# EAGLE design autoset-main (EAGLE 7.5.0)

## Sheet 1 of 2
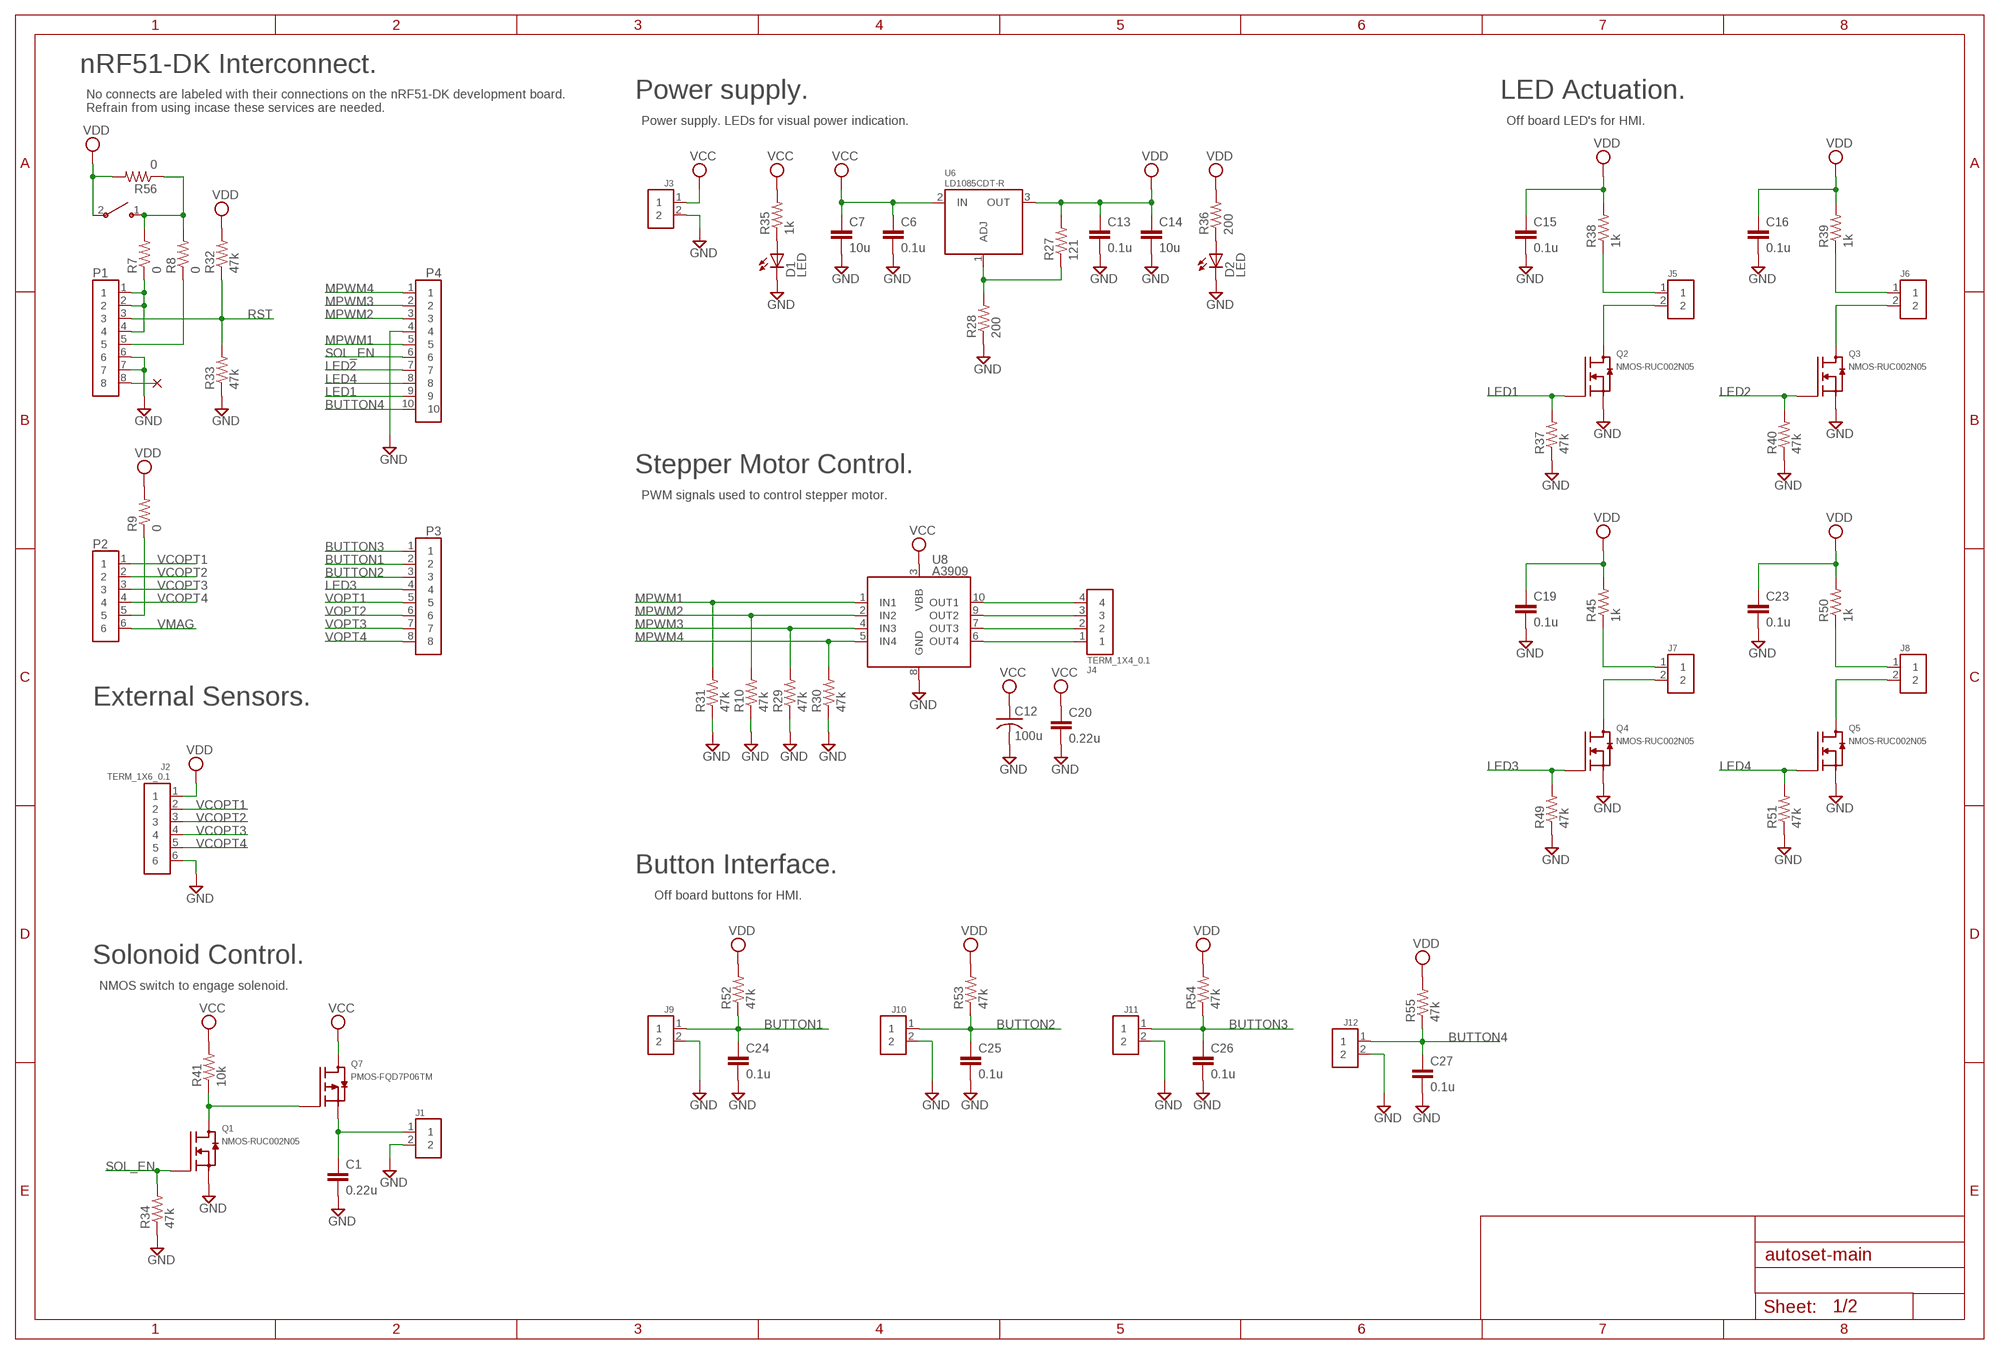
[diagram p0: schematic, sheet 1]

### Parts
C1  0.22u  C0603  [C0603]
C6  0.1u  C0603  [C0603]
C7  10u  C0603  [C0603]
C12  100u  C-POL3.5MM  [CPOL-3.5MM]
C13  0.1u  C0603  [C0603]
C14  10u  C0603  [C0603]
C15  0.1u  C0603  [C0603]
C16  0.1u  C0603  [C0603]
C19  0.1u  C0603  [C0603]
C20  0.22u  C0603  [C0603]
C23  0.1u  C0603  [C0603]
C24  0.1u  C0603  [C0603]
C25  0.1u  C0603  [C0603]
C26  0.1u  C0603  [C0603]
C27  0.1u  C0603  [C0603]
D1  LED  [L0805]
D2  LED  [L0805]
J1  TERM_1X2_0.1  [TERM_1X2_0.1]
J2  TERM_1X6_0.1  [TERM_1X6_0.1]
J3  TERM_1X2_0.1  [TERM_1X2_0.1]
J4  TERM_1X4_0.1  [TERM_1X4_0.1]
J5  TERM_1X2_0.1  [TERM_1X2_0.1]
J6  TERM_1X2_0.1  [TERM_1X2_0.1]
J7  TERM_1X2_0.1  [TERM_1X2_0.1]
J8  TERM_1X2_0.1  [TERM_1X2_0.1]
J9  TERM_1X2_0.1  [TERM_1X2_0.1]
J10  TERM_1X2_0.1  [TERM_1X2_0.1]
J11  TERM_1X2_0.1  [TERM_1X2_0.1]
J12  TERM_1X2_0.1  [TERM_1X2_0.1]
P1  RECT_1X8  [RECT_1X8_0.1]
P2  RECT_1X6  [RECT_1X6_0.1]
P3  RECT_1X8  [RECT_1X8_0.1]
P4  RECT_1X10  [RECT_1X10_0.1]
Q1  NMOS-RUC002N05  [SOT23]
Q2  NMOS-RUC002N05  [SOT23]
Q3  NMOS-RUC002N05  [SOT23]
Q4  NMOS-RUC002N05  [SOT23]
Q5  NMOS-RUC002N05  [SOT23]
Q7  PMOS-FQD7P06TM  [TO252]
R7  0  R0603  [R0603]
R8  0  R0603  [R0603]
R9  0  R0603  [R0603]
R10  47k  R0603  [R0603]
R27  121  R0603  [R0603]
R28  200  R0603  [R0603]
R29  47k  R0603  [R0603]
R30  47k  R0603  [R0603]
R31  47k  R0603  [R0603]
R32  47k  R0603  [R0603]
R33  47k  R0603  [R0603]
R34  47k  R0603  [R0603]
R35  1k  R0603  [R0603]
R36  200  R0603  [R0603]
R37  47k  R0603  [R0603]
R38  1k  R0603  [R0603]
R39  1k  R0603  [R0603]
R40  47k  R0603  [R0603]
R41  10k  R0603  [R0603]
R45  1k  R0603  [R0603]
R49  47k  R0603  [R0603]
R50  1k  R0603  [R0603]
R51  47k  R0603  [R0603]
R52  47k  R0603  [R0603]
R53  47k  R0603  [R0603]
R54  47k  R0603  [R0603]
R55  47k  R0603  [R0603]
R56  0  R0603  [R0603]
SW1  GPTS203211B  [GPTS203211B]
U6  LD1085CDT-R  [TO252]
U8  A3909  [SSOP10]
Z15  NC  [NC_TH]

### Nets
BUTTON1: C24.1 J9.1 P3.2 R52.1
BUTTON2: C25.1 J10.1 P3.3 R53.1
BUTTON3: C26.1 J11.1 P3.1 R54.1
BUTTON4: C27.1 J12.1 P4.10 R55.1
GND: C1.2 C6.2 C7.2 C12.P$2 C13.2 C14.2 C15.2 C16.2 C19.2 C20.2 C23.2 C24.2 C25.2 C26.2 C27.2 D1.2(C) D2.2(C) J1.2 J2.6 J3.2 J9.2 J10.2 J11.2 J12.2 P1.6 P1.7 P4.4 Q1.1(S) Q2.1(S) Q3.1(S) Q4.1(S) Q5.1(S) R10.1 R28.1 R29.1 R30.1 R31.1 R33.1 R34.1 R37.1 R40.1 R49.1 R51.1 U8.8(GND) ; also sheet 2
LED1: P4.9 Q2.2(G) R37.2
LED2: P4.7 Q3.2(G) R40.2
LED3: P3.4 Q4.2(G) R49.2
LED4: P4.8 Q5.2(G) R51.2
MPWM1: P4.5 R31.2 U8.1(IN1)
MPWM2: P4.3 R10.2 U8.2(IN2)
MPWM3: P4.2 R29.2 U8.4(IN3)
MPWM4: P4.1 R30.2 U8.5(IN4)
N$3: P1.8 Z15.P$1
N$4: J6.2 Q3.3(D)
N$5: R7.2 R8.2 R56.1 SW1.1
N$6: P1.1 P1.2 P1.4 R7.1
N$7: J4.4 U8.10(OUT1)
N$8: R27.1 R28.2 U6.1(ADJ)
N$10: J4.3 U8.9(OUT2)
N$12: J5.2 Q2.3(D)
N$14: J5.1 R38.1
N$16: J6.1 R39.1
N$18: J7.2 Q4.3(D)
N$19: J7.1 R45.1
N$20: J8.2 Q5.3(D)
N$21: J4.2 U8.7(OUT3)
N$22: J4.1 U8.6(OUT4)
N$23: J8.1 R50.1
N$24: P2.5 R9.1
N$29: C1.1 J1.1 Q7.3(D)
N$30: P1.5 R8.1
N$31: Q1.3(D) Q7.1(G) R41.1
N$33: D1.1(A) R35.1
N$34: D2.1(A) R36.1
RST: P1.3 R32.1 R33.2
SOL_EN: P4.6 Q1.2(G) R34.2
VCC: C6.1 C7.1 C12.P$1 C20.1 J3.1 Q7.2(S) R35.2 R41.2 U6.2(IN) U8.3(VBB)
VCOPT1: J2.2 P2.1
VCOPT2: J2.3 P2.2
VCOPT3: J2.4 P2.3
VCOPT4: J2.5 P2.4
VDD: C13.1 C14.1 C15.1 C16.1 C19.1 C23.1 J2.1 R9.2 R27.2 R32.2 R36.2 R38.2 R39.2 R45.2 R50.2 R52.2 R53.2 R54.2 R55.2 R56.2 SW1.2 U6.3(OUT) ; also sheet 2
VMAG: P2.6 ; also sheet 2
VOPT1: P3.5 ; also sheet 2
VOPT2: P3.6 ; also sheet 2
VOPT3: P3.7 ; also sheet 2
VOPT4: P3.8 ; also sheet 2

### Notes on the sheet
- nRF51-DK Interconnect.
- Power supply. | LED Actuation.
- No connects are labeled with their connections on the nRF51-DK development board. 
  Refrain from using incase these services are needed.
- Power supply. LEDs for visual power indication. | Off board LED's for HMI.
- Stepper Motor Control.
- PWM signals used to control stepper motor.
- External Sensors.
- Button Interface.
- Off board buttons for HMI.
- Solonoid Control.
- NMOS switch to engage solenoid.

## Sheet 2 of 2
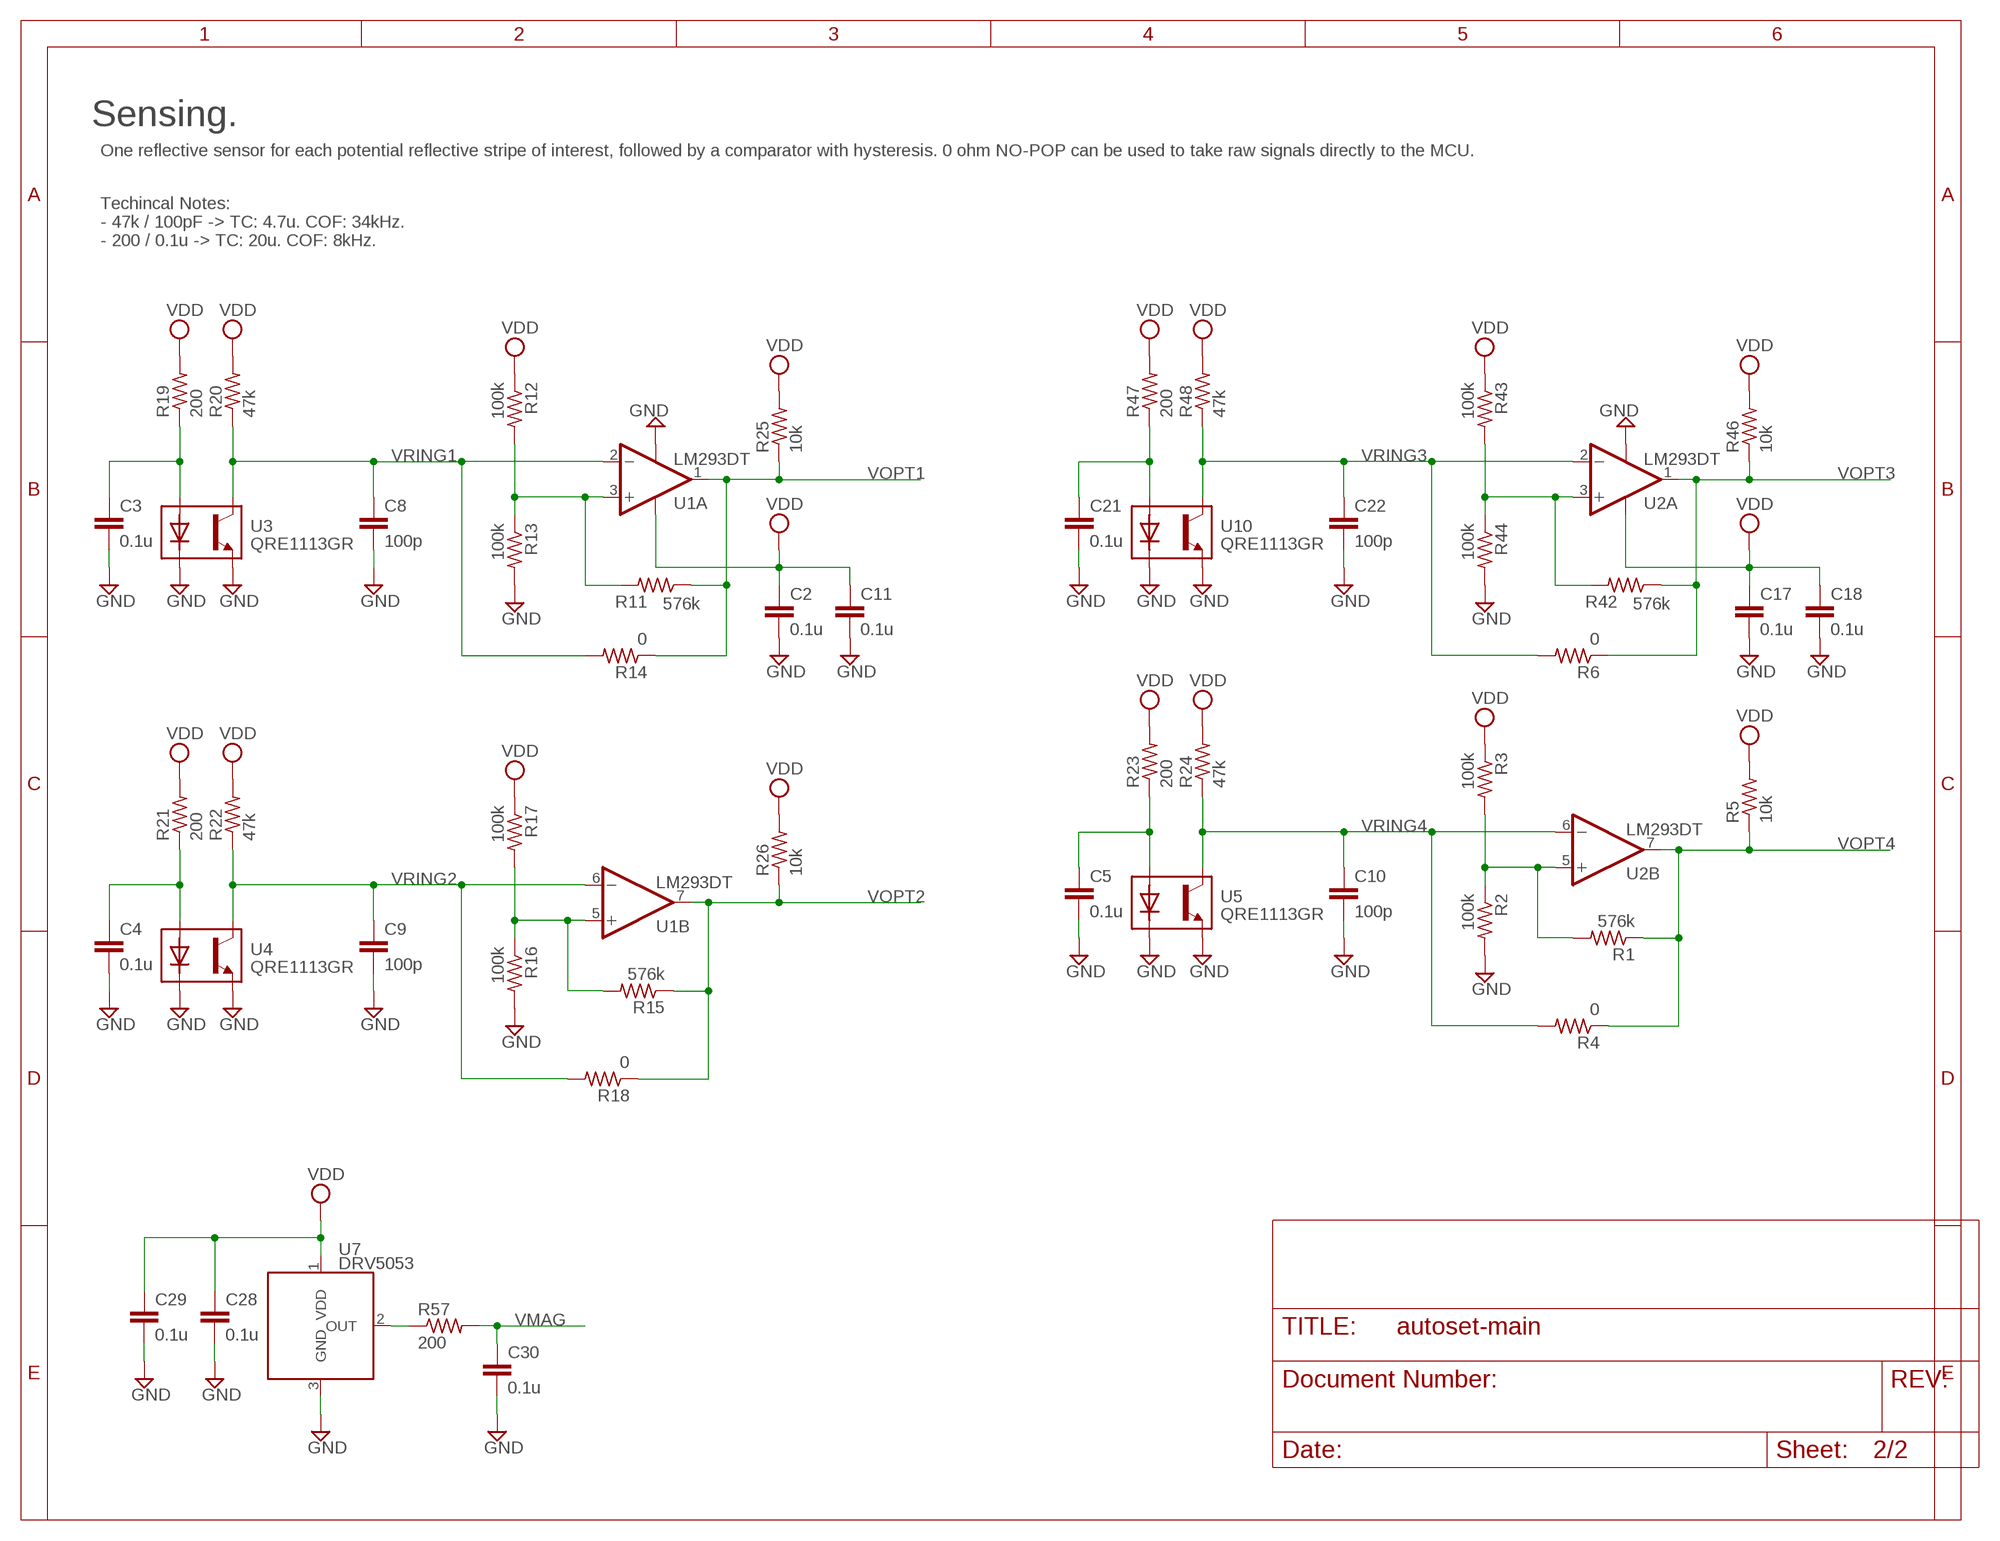
[diagram p1: schematic, sheet 2]

### Parts
C2  0.1u  C0603  [C0603]
C3  0.1u  C0603  [C0603]
C4  0.1u  C0603  [C0603]
C5  0.1u  C0603  [C0603]
C8  100p  C0603  [C0603]
C9  100p  C0603  [C0603]
C10  100p  C0603  [C0603]
C11  0.1u  C0603  [C0603]
C17  0.1u  C0603  [C0603]
C18  0.1u  C0603  [C0603]
C21  0.1u  C0603  [C0603]
C22  100p  C0603  [C0603]
C28  0.1u  C0603  [C0603]
C29  0.1u  C0603  [C0603]
C30  0.1u  C0603  [C0603]
R1  576k  R0603  [R0603]
R2  100k  R0603  [R0603]
R3  100k  R0603  [R0603]
R4  0  R0603  [R0603]
R5  10k  R0603  [R0603]
R6  0  R0603  [R0603]
R11  576k  R0603  [R0603]
R12  100k  R0603  [R0603]
R13  100k  R0603  [R0603]
R14  0  R0603  [R0603]
R15  576k  R0603  [R0603]
R16  100k  R0603  [R0603]
R17  100k  R0603  [R0603]
R18  0  R0603  [R0603]
R19  200  R0603  [R0603]
R20  47k  R0603  [R0603]
R21  200  R0603  [R0603]
R22  47k  R0603  [R0603]
R23  200  R0603  [R0603]
R24  47k  R0603  [R0603]
R25  10k  R0603  [R0603]
R26  10k  R0603  [R0603]
R42  576k  R0603  [R0603]
R43  100k  R0603  [R0603]
R44  100k  R0603  [R0603]
R46  10k  R0603  [R0603]
R47  200  R0603  [R0603]
R48  47k  R0603  [R0603]
R57  200  R0603  [R0603]
U1  LM293DT  [SOIC8]
U2  LM293DT  [SOIC8]
U3  QRE1113GR  [REFL]
U4  QRE1113GR  [REFL]
U5  QRE1113GR  [REFL]
U7  DRV5053  [SOT23]
U10  QRE1113GR  [REFL]

### Nets
GND: C2.2 C3.2 C4.2 C5.2 C8.2 C9.2 C10.2 C11.2 C17.2 C18.2 C21.2 C22.2 C28.2 C29.2 C30.2 R2.2 R13.2 R16.2 R44.2 U1.4(A:V-) U2.4(A:V-) U3.2(DC) U3.4(E) U4.2(DC) U4.4(E) U5.2(DC) U5.4(E) U7.3(GND) U10.2(DC) U10.4(E) ; also sheet 1
N$1: R1.2 R2.1 R3.2 U2.5(B:+IN)
N$2: R42.2 R43.2 R44.1 U2.3(A:+IN)
N$9: R11.2 R12.2 R13.1 U1.3(A:+IN)
N$11: C3.1 R19.1 U3.1(DA)
N$13: R15.2 R16.1 R17.2 U1.5(B:+IN)
N$15: C4.1 R21.1 U4.1(DA)
N$17: C5.1 R23.1 U5.1(DA)
N$25: R57.1 U7.2(OUT)
N$44: C21.1 R47.1 U10.1(DA)
VDD: C2.1 C11.1 C17.1 C18.1 C28.1 C29.1 R3.1 R5.2 R12.1 R17.1 R19.2 R20.2 R21.2 R22.2 R23.2 R24.2 R25.2 R26.2 R43.1 R46.2 R47.2 R48.2 U1.8(A:V+) U2.8(A:V+) U7.1(VDD) ; also sheet 1
VMAG: C30.1 R57.2 ; also sheet 1
VOPT1: R11.1 R14.1 R25.1 U1.1(A:OUT) ; also sheet 1
VOPT2: R15.1 R18.1 R26.1 U1.7(B:OUT) ; also sheet 1
VOPT3: R6.1 R42.1 R46.1 U2.1(A:OUT) ; also sheet 1
VOPT4: R1.1 R4.1 R5.1 U2.7(B:OUT) ; also sheet 1
VRING1: C8.1 R14.2 R20.1 U1.2(A:-IN) U3.3(C)
VRING2: C9.1 R18.2 R22.1 U1.6(B:-IN) U4.3(C)
VRING3: C22.1 R6.2 R48.1 U2.2(A:-IN) U10.3(C)
VRING4: C10.1 R4.2 R24.1 U2.6(B:-IN) U5.3(C)

### Notes on the sheet
- Sensing.
- One reflective sensor for each potential reflective stripe of interest, followed by a comparator with hysteresis. 0 ohm NO-POP can be used to take raw signals directly to the MCU.
- Techincal Notes:
  - 47k / 100pF -> TC: 4.7u. COF: 34kHz.
  - 200 / 0.1u -> TC: 20u. COF: 8kHz.

## Library data of the parts
C1 C20 = dsantoro-discrete:C; DKPN: 490-8017-1-ND
C2-C6 C11 C13 C15-C19 C21 C23-C30 = dsantoro-discrete:C; DKPN: 490-1519-1-ND
C7 C14 = dsantoro-discrete:C; DKPN: 490-7202-1-ND
C8-C10 C22 = dsantoro-discrete:C; DKPN: 490-4767-1-ND
C12 = dsantoro-discrete:C-POL; DKPN: 493-10432-1-ND
D1 = dsantoro-discrete:LED; DKPN: 475-1415-1-ND
D2 = dsantoro-discrete:LED; DKPN: 475-1410-1-ND
J1 J3 J5-J12 = dsantoro-conn:TERM_1X2_0.1; DKPN: ED10561-ND
J2 = dsantoro-conn:TERM_1X6_0.1; DKPN: ED10565-ND
J4 = dsantoro-conn:TERM_1X4_0.1; DKPN: ED10563-ND
P1 P3 = dsantoro-conn:RECT_1X8; DKPN: S1011EC-08-ND
P2 = dsantoro-conn:RECT_1X6; DKPN: S1011EC-06-ND
P4 = dsantoro-conn:RECT_1X10; DKPN: S1011EC-10-ND
Q1-Q5 = dsantoro-discrete:NMOS-RUC002N05; DKPN: RUC002N05T116CT-ND
Q7 = dsantoro-discrete:PMOS-FQD7P06TM; DKPN: FQD7P06TMCT-ND
R1 R11 R15 R42 = dsantoro-discrete:R; DKPN: 311-576KHRCT-ND
R2 R3 R12 R13 R16 R17 R43 R44 = dsantoro-discrete:R; DKPN: RHM100KDCT-ND
R4 R6-R9 R14 R18 R56 = dsantoro-discrete:R; DKPN: 541-2779-1-ND
R5 R25 R26 R41 R46 = dsantoro-discrete:R; DKPN: RHM10KDCT-ND
R10 R20 R22 R24 R29-R34 R37 R40 R48 R49 R51-R55 = dsantoro-discrete:R; DKPN: RHM47KDCT-ND
R19 R21 R23 R28 R36 R47 R57 = dsantoro-discrete:R; DKPN: RHM200DCT-ND
R27 = dsantoro-discrete:R; DKPN: 311-121HRCT-ND
R35 R38 R39 R45 R50 = dsantoro-discrete:R; DKPN: RHM1.0KDCT-ND
SW1 = dsantoro-sw:GPTS203211B; DKPN: CW181-ND
U1 U2 = dsantoro-op:LM293; DKPN: 497-1566-1-ND
U3-U5 U10 = dsantoro-sens:QRE1113; DKPN: QRE1113GRCT-ND
U6 = dsantoro-pwr:LD1085CDT; DKPN: 497-3418-1-ND
U7 = dsantoro-sens:DRV5053; DKPN: 296-38460-1-ND
U8 = dsantoro-misc:A3909; DKPN: 620-1498-1-ND
Z15 = dsantoro-dir:NC

## Board
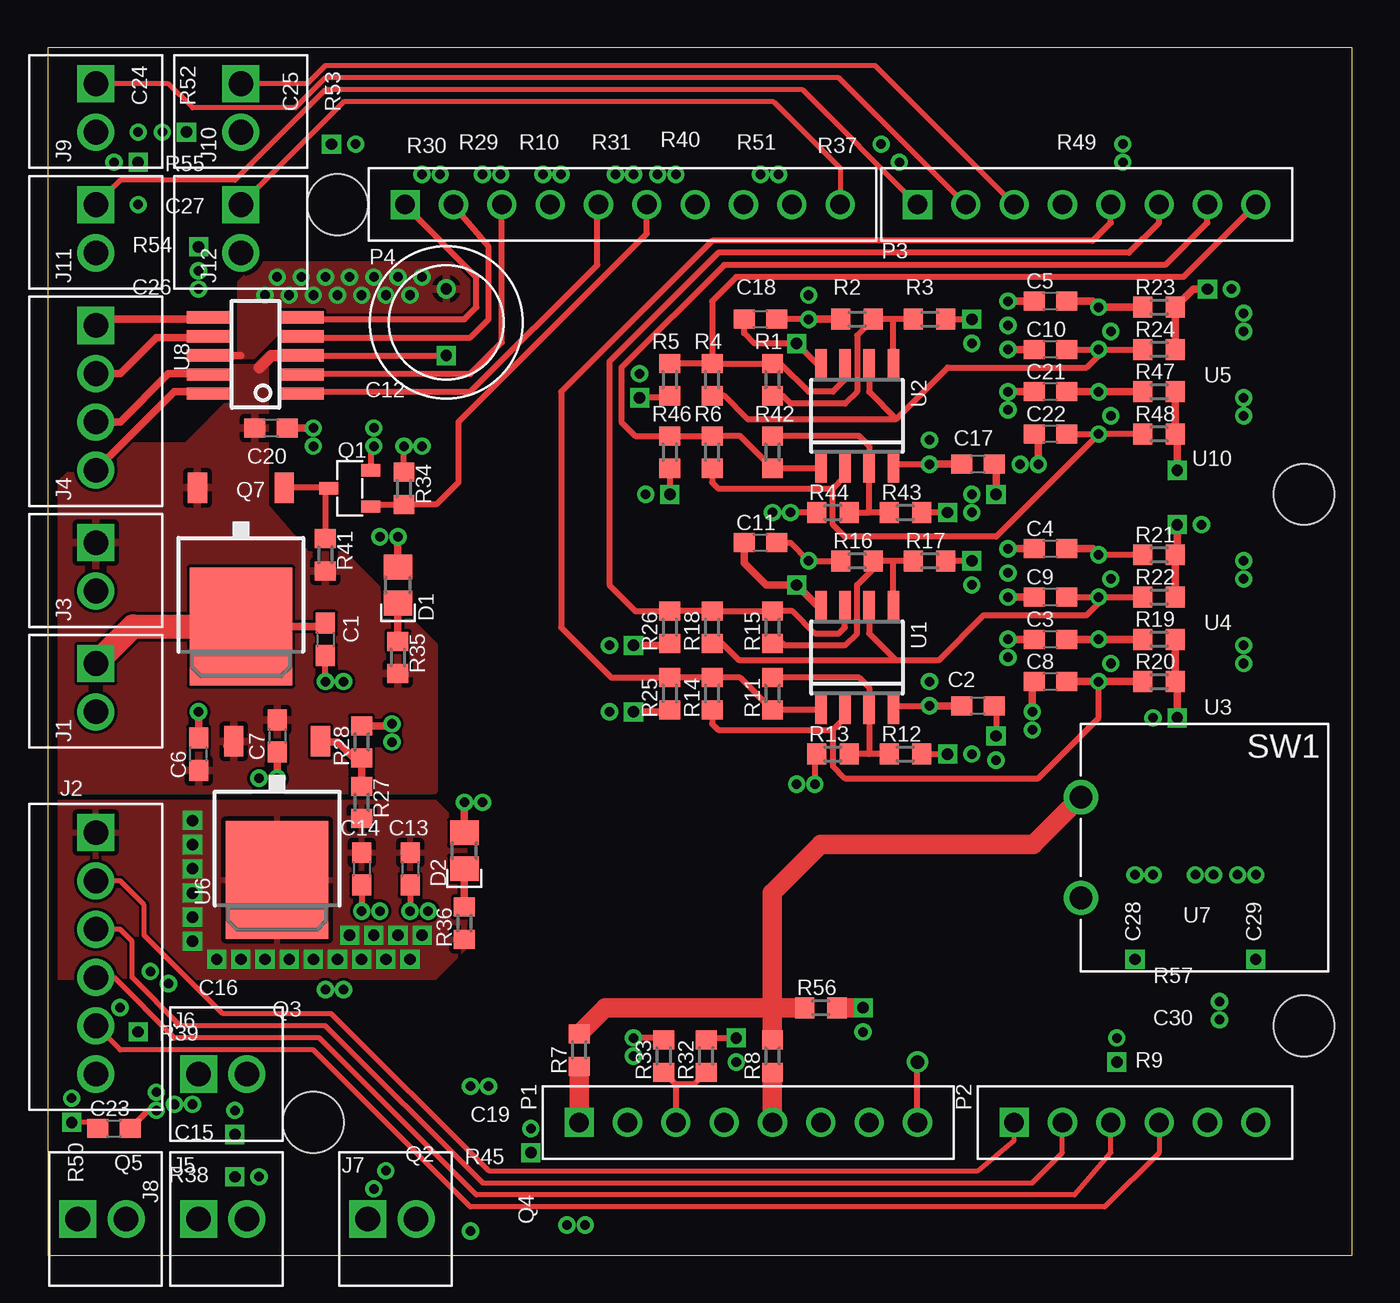
[diagram p2: board, top side]
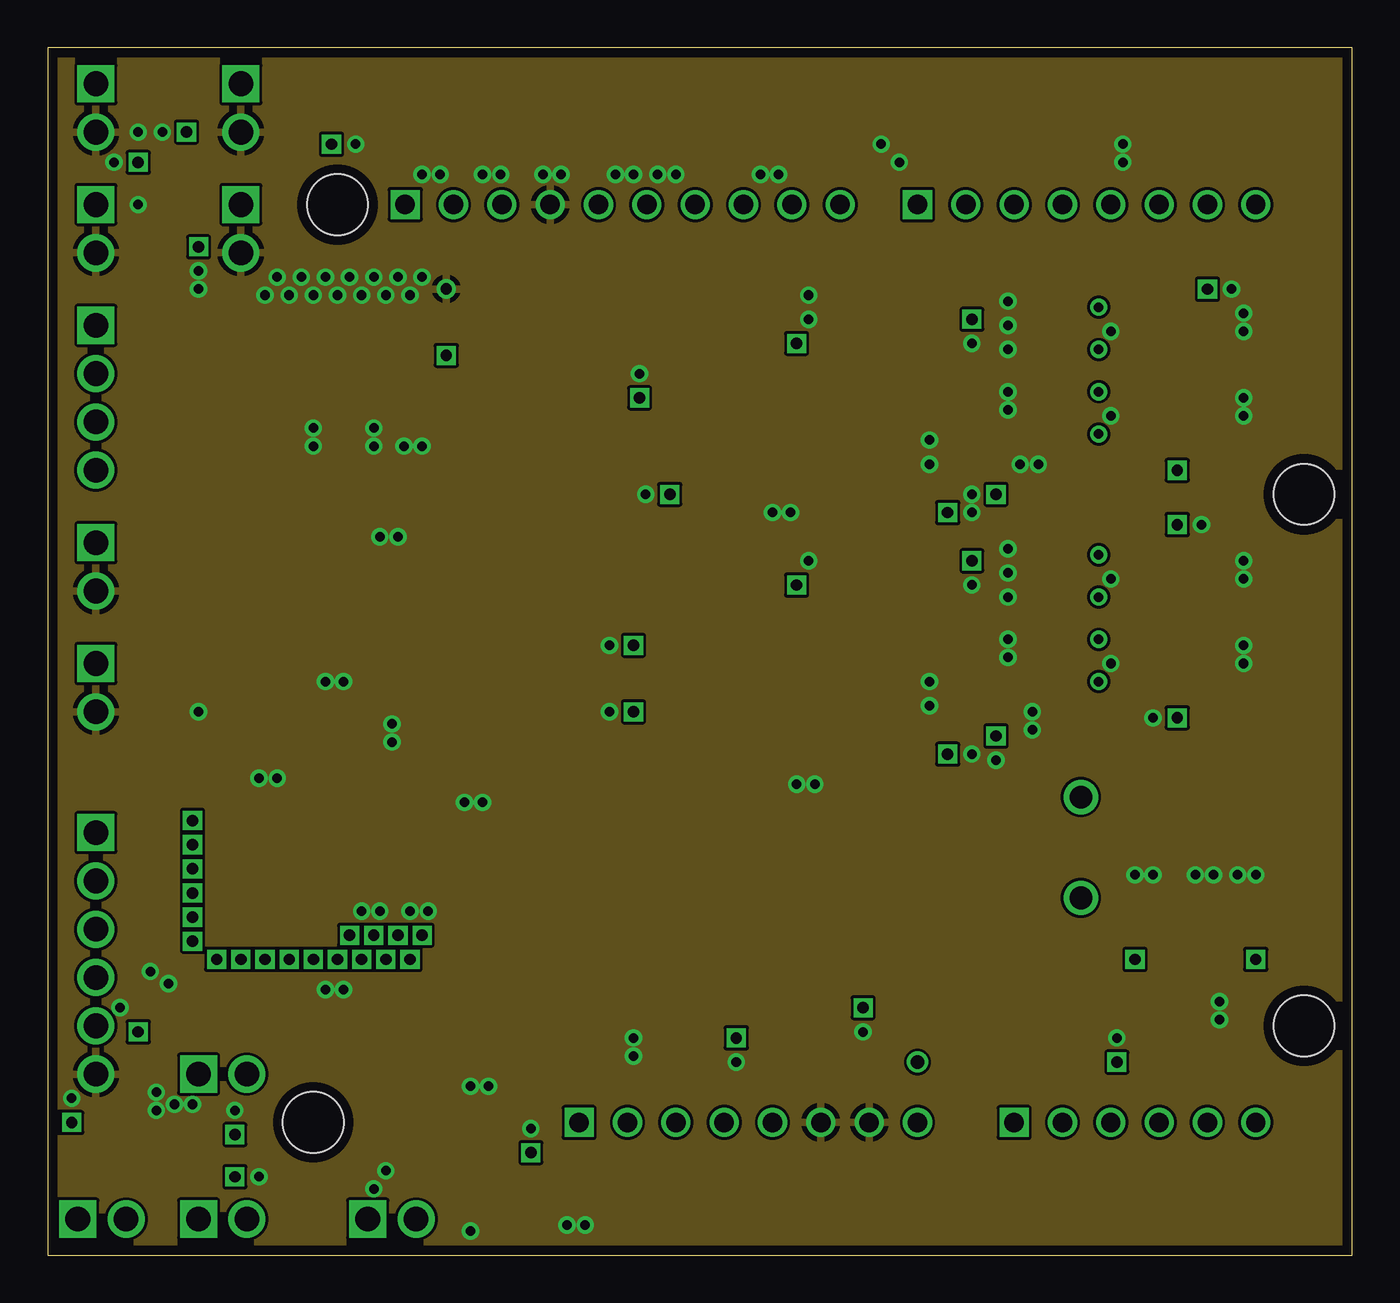
[diagram p3: board, inner layer GND]
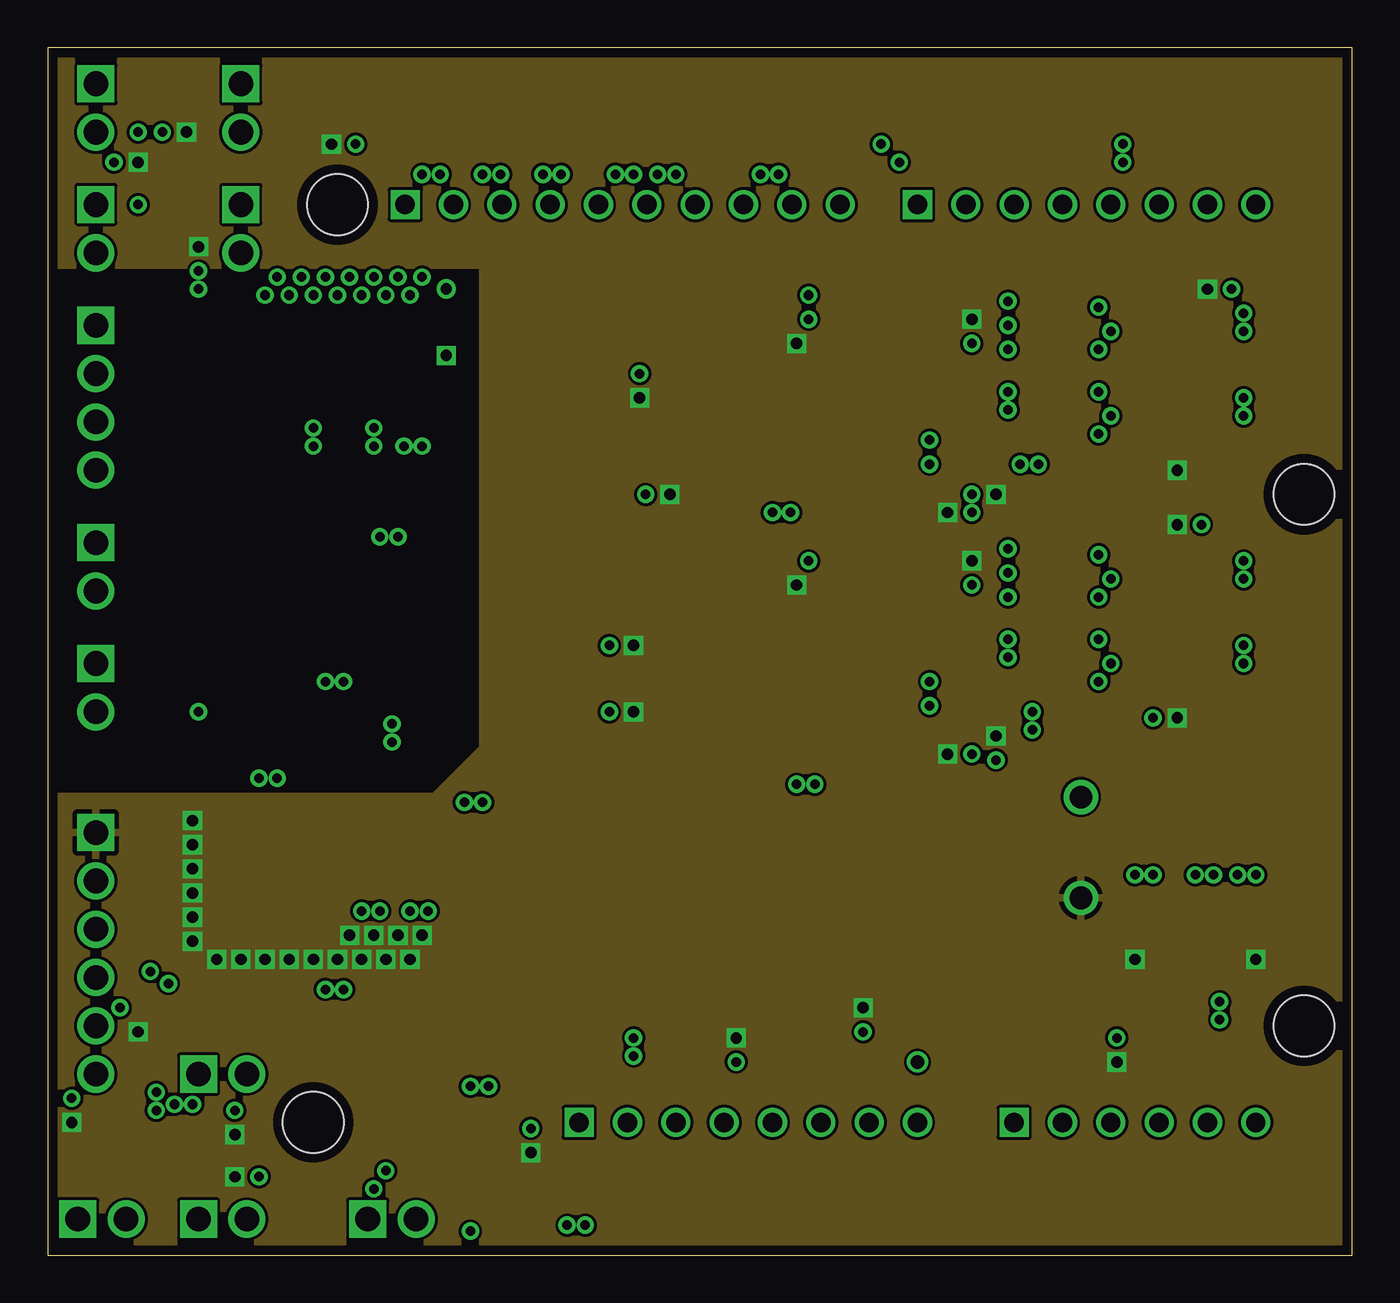
[diagram p4: board, inner layer VDD]
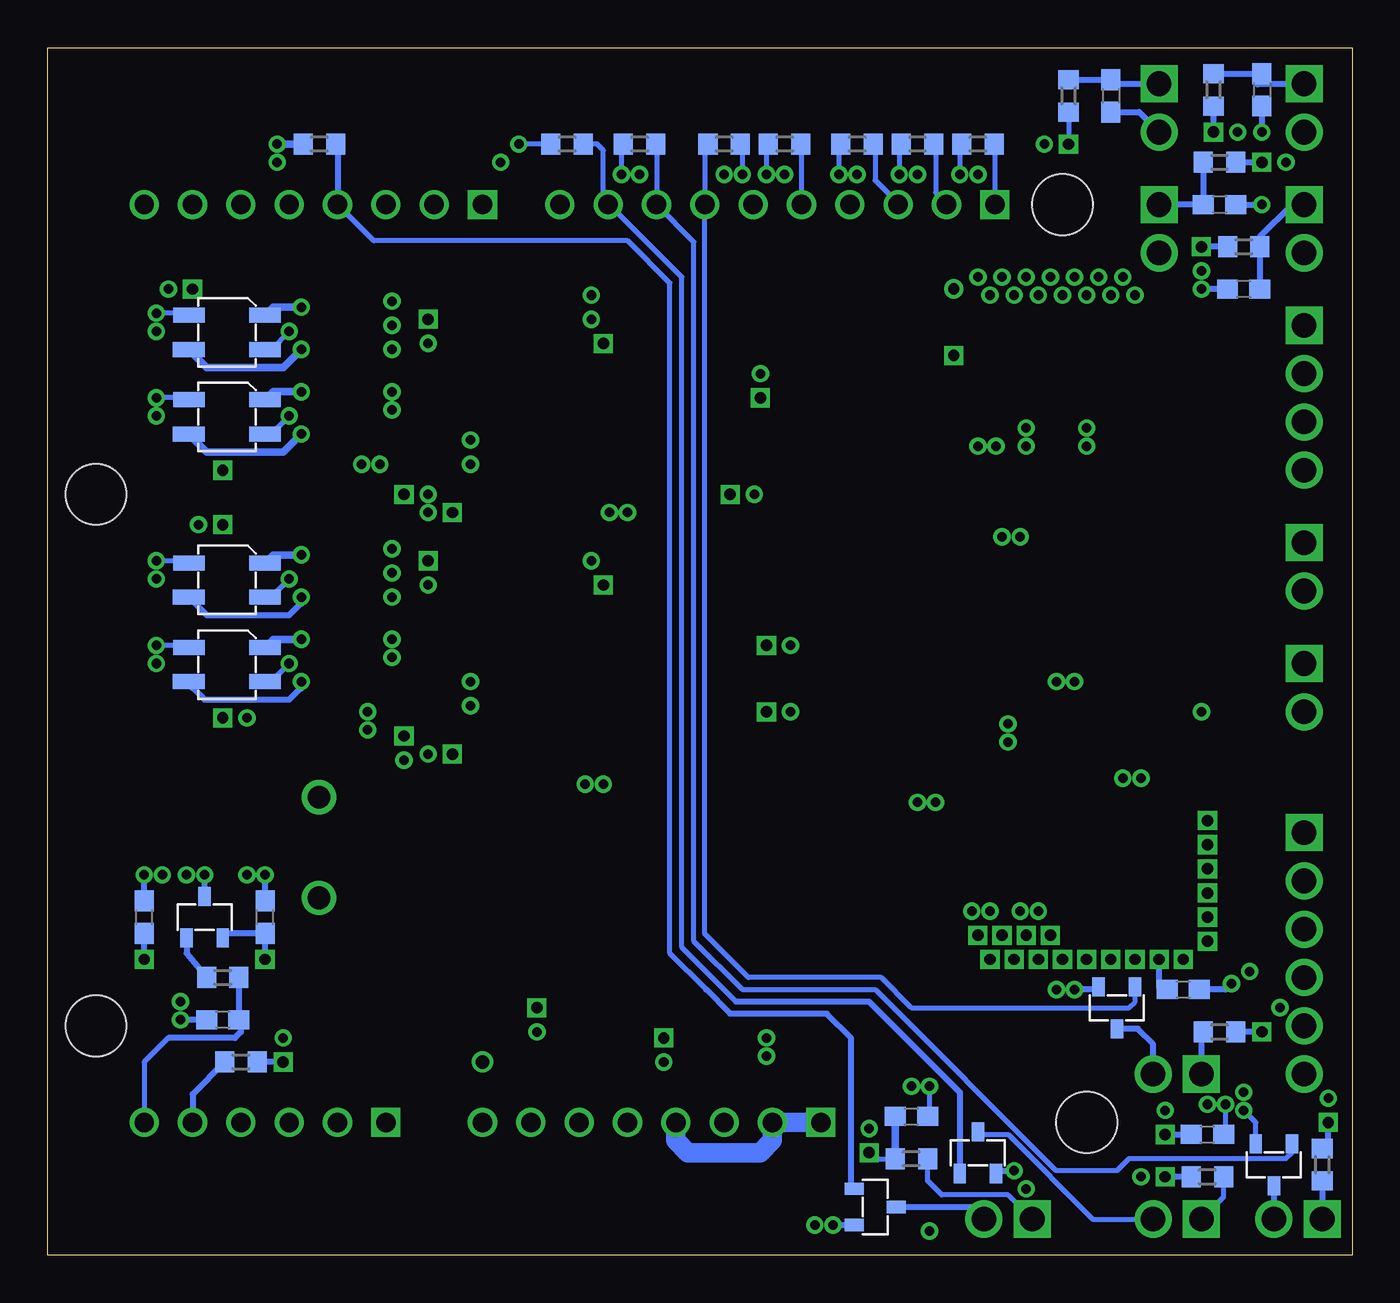
[diagram p5: board, bottom side, seen from below]

Size 68.58 x 63.5 mm. Coordinates in mm from the lower left corner, seen from the top.
Outline: 0,0 68.58,0 68.58,63.5 0,63.5 0,0
Copper layers (1+2*15+16): Top 0.0178mm / dielectric 12mil / GND 0.0356mm / dielectric 28mil / VDD 0.0356mm / dielectric 12mil / Bottom 0.0178mm
Design rules "SSC-EAGLE-4Lyr_v1.0.0.3": minimum track width 6mil, minimum drill 8mil, track to track 6mil, track to pad 6mil, pad to pad 6mil, via to via 6mil, smd to smd 6mil, copper to edge 20mil, drill to drill 16mil, minimum pad ring 8mil, minimum via ring 8mil, stop-mask expansion 3mil, vias tented up to drill 0mil, thermal gap 10mil
Holes 3.2 mm at 66.04,12.06 66.04,40.01 15.24,55.24 13.97,6.99

### Footprints (pad centres in the part's own frame; a part is rotated, then mirrored left to right if it is on the bottom)
C0603 = smd 1.1 x 1: 1 -0.85,0; 2 0.85,0
CPOL-3.5MM = drill 0.6 square: P$1 0,0 | drill 0.6: P$2 0,-3.5
L0805 = smd 1.3 x 1.5: 1 -0.95,0; 2 0.95,0
TERM_1X2_0.1 = drill 1.3 square: 1 0,0 | drill 1.3: 2 0,-2.54
TERM_1X6_0.1 = drill 1.3 square: 1 0,0 | drill 1.3: 2 0,-2.54; 3 0,-5.08; 4 0,-7.62; 5 0,-10.16; 6 0,-12.7
TERM_1X4_0.1 = drill 1.3 square: 1 0,0 | drill 1.3: 2 0,-2.54; 3 0,-5.08; 4 0,-7.62
RECT_1X8_0.1 = drill 1.02 square: 1 0,0 | drill 1.02: 2 0,-2.54; 3 0,-5.08; 4 0,-7.62; 5 0,-10.16; 6 0,-12.7; 7 0,-15.24; 8 0,-17.78
RECT_1X6_0.1 = drill 1.02 square: 1 0,0 | drill 1.02: 2 0,-2.54; 3 0,-5.08; 4 0,-7.62; 5 0,-10.16; 6 0,-12.7
RECT_1X10_0.1 = drill 1.02 square: 1 0,0 | drill 1.02: 2 0,-2.54; 3 0,-5.08; 4 0,-7.62; 5 0,-10.16; 6 0,-12.7; 7 0,-15.24; 8 0,-17.78; 9 0,-20.32; 10 0,-22.86
SOT23 = smd 0.65 x 1: 1 0.955,-1.1; 2 -0.955,-1.1; 3 0,1.1
TO252 = smd 1 x 1.6: 1 -2.28,-4.8; 2 2.28,-4.8 | smd 5.4 x 6.2: 3 0,2.5
R0603 = smd 1 x 1.1: 1 -0.85,0; 2 0.85,0
GPTS203211B = drill 1.2: 1 13,3.85; 2 13,9.15
SOIC8 = smd 0.6 x 1.5: 1 -1.905,-2.75; 2 -0.635,-2.75; 3 0.635,-2.75; 4 1.905,-2.75; 5 1.905,2.75; 6 0.635,2.75; 7 -0.635,2.75; 8 -1.905,2.75
REFL = smd 1.66 x 0.79: 1 0,-1.8; 2 4,-1.8; 3 4.01,0; 4 0,0
SSOP10 = smd 0.65 x 2.25: 1 -2,-1.95; 2 -1,-1.95; 3 0,-1.95; 4 1,-1.95; 5 2,-1.95; 6 2,3; 7 1,3; 8 0,3; 9 -1,3; 10 -2,3
NC_TH = drill 0.7: P$1 0,0

### Placement (x,y rotation side)
C1  14.61,32.38 270 top
C2  48.9,28.89 180 top
C3  52.7,32.38 180 top
C4  52.7,37.15 180 top
C5  52.7,50.16 180 top
C6  7.94,26.35 90 top
C7  12.06,27.3 270 top
C8  52.7,30.16 180 top
C9  52.7,34.61 180 top
C10  52.7,47.62 180 top
C11  37.47,37.47 0 top
C12  20.95,47.31 180 top
C13  19.05,20.32 270 top
C14  16.51,20.32 270 top
C15  7.62,6.35 0 bottom
C16  8.89,13.97 0 bottom
C17  48.9,41.59 180 top
C18  37.47,49.21 0 top
C19  23.18,7.3 0 bottom
C20  11.75,43.5 0 top
C21  52.7,45.4 180 top
C22  52.7,43.18 180 top
C23  3.49,6.67 0 top
C24  4.76,61.28 270 bottom
C25  12.7,60.96 270 bottom
C26  5.71,50.8 180 bottom
C27  6.99,55.24 0 bottom
C28  57.15,17.78 90 bottom
C29  63.5,17.78 90 bottom
C30  59.37,12.38 180 bottom
D1  18.41,35.24 90 top
D2  21.91,21.27 90 top
J1  2.54,31.11 0 top
J2  2.54,22.23 0 top
J3  2.54,37.47 0 top
J4  2.54,48.9 0 top
J5  7.94,1.91 90 top
J6  7.94,9.53 90 top
J7  16.83,1.91 90 top
J8  1.59,1.91 90 top
J9  2.54,61.59 0 top
J10  10.16,61.59 0 top
J11  2.54,55.24 0 top
J12  10.16,55.24 0 top
P1  27.94,6.99 90 top
P2  50.8,6.99 90 top
P3  45.72,55.24 90 top
P4  18.8,55.24 90 top
Q1  15.88,40.32 90 top
Q2  19.68,5.4 0 bottom
Q3  12.38,13.02 180 bottom
Q4  25.08,2.54 270 bottom
Q5  4.13,4.76 180 bottom
Q7  10.16,35.56 180 top
R1  38.1,46.04 270 top
R2  42.55,49.21 180 top
R3  46.35,49.21 180 top
R4  34.92,46.04 270 top
R5  32.7,46.04 270 top
R6  34.92,42.23 270 top
R7  27.94,10.79 90 top
R8  38.1,10.48 90 top
R9  58.42,10.16 0 bottom
R10  26.04,58.42 0 bottom
R11  38.1,29.53 90 top
R12  45.09,26.35 180 top
R13  41.27,26.35 180 top
R14  34.92,29.53 270 top
R15  38.1,33.02 270 top
R16  42.55,36.51 180 top
R17  46.35,36.51 180 top
R18  34.92,33.02 270 top
R19  58.42,32.38 0 top
R20  58.42,30.16 0 top
R21  58.42,36.83 0 top
R22  58.42,34.61 0 top
R23  58.42,49.85 0 top
R24  58.42,47.62 0 top
R25  32.7,29.53 270 top
R26  32.7,33.02 270 top
R27  16.51,23.81 270 top
R28  16.51,26.99 270 top
R29  22.86,58.42 0 bottom
R30  19.68,58.42 0 bottom
R31  29.84,58.42 0 bottom
R32  34.61,10.48 90 top
R33  32.38,10.48 270 top
R34  18.73,40.32 270 top
R35  18.41,31.43 270 top
R36  21.91,17.46 270 top
R37  41.27,58.42 0 bottom
R38  7.62,4.13 180 bottom
R39  6.99,11.75 0 bottom
R40  33.02,58.42 180 bottom
R41  14.61,36.83 270 top
R42  38.1,42.23 90 top
R43  45.09,39.05 180 top
R44  41.27,39.05 180 top
R45  23.18,5.08 180 bottom
R46  32.7,42.23 270 top
R47  58.42,45.4 0 top
R48  58.42,43.18 0 top
R49  54.29,58.42 0 bottom
R50  1.59,4.76 90 bottom
R51  37.47,58.42 0 bottom
R52  7.3,61.28 270 bottom
R53  14.92,60.96 270 bottom
R54  5.71,53.02 180 bottom
R55  6.99,57.47 0 bottom
R56  40.64,13.02 0 top
R57  59.37,14.61 0 bottom
SW1  67.31,27.94 180 top
U1  42.55,31.43 0 top
U2  42.55,44.13 0 top
U3  57.15,30.16 180 bottom
U4  57.15,34.61 180 bottom
U5  57.15,47.62 180 bottom
U6  12.06,22.23 180 top
U7  60.33,17.78 0 bottom
U8  11.43,47.31 90 top
U10  57.15,43.18 180 bottom
Z15  45.72,10.16 90 top

### Tracks (layer width: path | path; a pad name or v marks a point on that pad's centre or on a via)
BUTTON1
  Top 0.254: P3.2 41.59,61.91 14.61,61.91 13.02,60.33 7.62,60.33 6.35,61.59 J9.1
  Bottom 0.305: 4.98,61.59 J9.1 | R52.1 C24.1
  Bottom 0.406: C24.1 4.98,61.59
BUTTON2
  Top 0.254: P3.3 43.5,62.55 14.61,62.55 13.65,61.59 J10.1
  Bottom 0.305: 12.6,61.59 J10.1 | R53.1 C25.1
  Bottom 0.406: C25.1 12.6,61.59
BUTTON3
  Top 0.254: P3.1 39.69,61.28 14.61,61.28 9.84,56.52 3.81,56.52 J11.1
  Bottom 0.305: C26.1 R54.1 4.87,53.55 3.17,55.24 J11.1
  Bottom 0.406: C26.1 4.76,51.02
BUTTON4
  Top 0.254: J12.1 15.56,60.64 38.16,60.64 41.66,57.15 P4.10
  Bottom 0.305: R55.1 C27.1 J12.1
GND  (via drill 0.5)
  Top 0.305: R16.2 v40.01,36.51 39.05,37.47 C11.2 | R44.2 v39.05,39.05 | U2.4 44.66,41.59 v46.35,41.59 | v40.01,49.21 C18.2 | U1.4 44.66,28.89 v46.35,28.89 | v14.61,30.16 C1.2 | R34.1 v18.73,42.55 | C13.2 v19.05,18.1 | C14.2 v16.51,18.1 | v17.14,42.55 16.98,42.38 Q1.1 | C23.2 5.29,7.62 v5.71,7.62 | R13.2 40.32,26.25 v40.32,24.77 | R33.1 32.28,11.43 v30.8,11.43
  Top 0.406: R2.2 v40.01,49.21 | C2.2 v46.35,28.89 | C17.2 v46.35,41.59 | D2.2 v21.91,23.81 | D1.2 v18.41,37.78 | U8.8 10.16,47.31 | C20.2 v13.97,43.5 | C6.2 v7.94,28.57 | v12.06,25.08 C7.2 | v18.1,27.94 18,27.84 R28.1 | C8.2 51.75,30.06 v51.75,28.57 | C3.2 v50.48,32.38 | C9.2 v50.48,34.61 | C4.2 v50.48,37.15 | C22.2 52.07,42.97 v52.07,41.59 | C21.2 v50.48,45.4 | C5.2 v50.48,50.16 | C10.2 v50.48,47.62
  Bottom 0.254: R37.1 v43.81,58.42 | R31.1 30.8,58.52 v30.8,56.83 | R10.1 26.99,58.52 v26.99,56.83 | R29.1 23.81,58.52 v23.81,56.83 | R30.1 20.64,58.52 v20.64,56.83 | R51.1 38.42,58.32 v38.42,56.83 | U5.2 61.26,49.53 v62.87,49.53 | U10.2 61.26,45.09 v62.87,45.09 | U4.2 61.26,36.51 v62.87,36.51 | U3.2 61.26,32.07 v62.87,32.07 | v55.88,31.11 56.83,30.16 U3.4 | v55.88,35.56 56.83,34.61 U4.4 | v55.88,48.58 56.83,47.62 U5.4 | v55.88,44.13 56.83,43.18 U10.4 | Q5.1 5.08,6.99 v5.71,7.62 | C15.2 6.67,6.45 v6.67,7.94 | C19.2 22.23,7.09 v22.23,8.89 | R40.1 32.07,58.32 v32.07,56.83
  Bottom 0.305: C25.2 11.21,60.11 J10.2 | C24.2 v4.76,59.05 | C26.2 v7.94,50.8 | Q4.1 v27.3,1.59 | Q2.1 18.56,4.45 v17.78,4.45 | Q3.1 13.48,13.97 v14.61,13.97 | v6.35,14.29 6.67,13.97 C16.2 | C29.2 v63.5,20 | C28.2 v57.15,20 | U7.3 v60.33,20 | C30.2 v61.59,12.38 | C27.2 v4.76,55.24
  Bottom 0.406: R49.1 v56.52,58.42
  other vias: 15.88,51.44 17.78,50.48 16.51,50.48 14.61,51.44 13.34,51.44 17.14,51.44 19.68,51.44 19.05,50.48 18.41,51.44 12.06,51.44 30.8,10.48 15.56,30.16 13.97,42.55 26.04,56.83 22.86,56.83 19.68,42.55 17.46,18.1 20,18.1 18.1,26.99 22.86,23.81 17.46,37.78 11.11,25.08 15.24,50.48 12.7,50.48 13.97,50.48 11.43,50.48 6.03,59.05 16.19,58.42 7.94,51.75 31.11,46.35 31.43,40.01 48.58,26.35 51.75,27.62 17.14,43.5 28.26,1.59 22.23,1.27 23.18,8.89 7.62,7.94 9.84,7.62 17.14,3.49 5.71,8.57 1.27,8.26 15.56,13.97 5.4,14.92 3.81,13.02 39.37,24.77 44.77,57.47 37.47,56.83 29.84,56.83 19.68,56.83 62.87,48.58 62.87,44.13 62.87,35.56 62.87,31.11 60.64,38.42 62.23,50.8 58.1,28.26 29.53,32.07 29.53,28.57 50.48,35.88 50.48,31.43 49.85,26.04 48.58,40.01 50.48,44.45 51.12,41.59 50.48,48.9 56.52,57.47 38.1,39.05 46.35,42.86 48.58,47.94 40.01,50.48 48.58,39.05 48.58,35.24 46.35,30.16 56.2,11.43 36.2,10.16 42.86,11.75 62.55,20 58.1,20 61.28,20 61.59,13.34 3.49,57.47 25.4,6.67 11.11,4.13 33.02,56.83
  pour GND: 0,64.77 68.58,64.77 68.58,0 0,0
  pour Top: 10.79,47.31 12.7,49.21 21.59,49.21 22.23,49.85 22.23,51.44 21.59,52.07 11.11,52.07 10.16,51.12 10.16,47.31
LED1
  Bottom 0.254: 32.38,13.34 35.24,16.19 35.24,51.44 39.05,55.24 P4.9 39.37,55.5 39.37,58.1 39.69,58.42 R37.2 | 20.64,8.57
  Bottom 0.305: 20.64,8.57 25.4,13.34 32.38,13.34 | 20.64,8.57 Q2.2
LED2
  Bottom 0.254: 34.04,55.18 P4.7 | P4.7 34.04,16.89 31.75,14.61 24.77,14.61 23.18,13.02 11.75,13.02 11.43,13.34 Q3.2 | R40.2 34.04,58.25 P4.7
  Bottom 0.305: Q3.2
LED3
  Bottom 0.254: 33.97,13.97 35.88,15.88 35.88,51.12 38.1,53.34 51.44,53.34 P3.4
  Bottom 0.305: Q4.2 26.35,3.67 26.35,11.43 27.62,12.7 32.7,12.7 33.97,13.97 | R49.2 53.34,58.32 P3.4
LED4
  Bottom 0.254: 3.17,6.18 3.17,5.4 3.49,5.08 11.75,5.08 12.38,4.45 15.56,4.45 25.08,13.97 32.07,13.97 34.61,16.51 34.61,53.28 P4.8 36.58,58.38 R51.2
  Bottom 0.305: Q5.2 3.17,6.18
MPWM1
  Top 0.305: U8.1 13.47,45.4 22.23,45.4 28.89,52.07 28.89,55.24 P4.5
  Bottom 0.254: R31.2 28.96,58.06 P4.5
MPWM2
  Top 0.305: U8.2 13.43,46.35 22.23,46.35 23.88,48.01 P4.3
  Bottom 0.254: R10.2 25.08,58.32 25.08,56.52 23.88,55.31 P4.3
MPWM3
  Top 0.305: U8.4 13.43,48.26 22.23,48.26 23.18,49.21 23.18,53.02 21.34,55.18 P4.2
  Bottom 0.254: R29.2 21.91,58.32 21.91,55.88 21.34,55.31 P4.2
  Bottom 0.305: 21.38,55.24 P4.2
MPWM4
  Top 0.305: U8.5 13.47,49.21 21.91,49.21 22.54,49.85 22.54,51.44 18.8,55.18 P4.1
  Bottom 0.254: R30.2 18.8,58.38 P4.1
N$1
  Top 0.305: R3.2 44.45,49.21 | 44.45,49.21 R2.1 42.55,48.36 42.55,45.4 41.91,44.77 39.05,44.77 38.63,45.19 R1.2 | U2.5 44.45,49.21
N$2
  Top 0.305: R44.1 43.18,39.05 | R42.2 42.65,43.08 43.18,42.55 U2.3 43.18,39.05 | R43.2 43.18,39.05
N$3
  Top 0.305: P1.8 Z15.P$1
N$4
  Bottom 0.305: J6.2 10.48,11.11 11.28,11.92 Q3.3
N$5
  Top 1.016: SW1.1 51.81,21.59 40.64,21.59 38.1,19.05 38.1,13.02 | 38.1,13.02 R8.2 | R7.2 29.31,13.02 37.78,13.02 38.1,13.02 | R56.1 38.1,13.02
N$6
  Top 1.016: R7.1 P1.1
  Bottom 1.016: P1.1 P1.2 30.48,6.03 31.11,5.4 34.92,5.4 35.56,6.03 P1.4
N$7
  Top 0.305: U8.10 8.34,45.4
  Top 0.406: 8.34,45.4 6.67,45.4 J4.4
N$8
  Top 0.406: R28.2 R27.1 16.51,25.72 15.24,26.99 14.38,26.99 U6.1
N$9
  Top 0.305: R12.2 43.18,26.35 | 43.18,26.35 R13.1 | R11.2 42.65,30.38 43.18,29.84 U1.3 43.18,26.35
N$10
  Top 0.305: U8.9 8.38,46.35
  Top 0.406: 8.38,46.35 6.35,46.35 3.81,43.81 J4.3
N$11  (via drill 0.5)
  Top 0.406: R19.1 v55.24,32.38 C3.1
  Bottom 0.406: U3.1 56.73,32.38 v55.24,32.38
N$12
  Bottom 0.254: Q2.3 19.54,6.35 18.1,6.35 13.65,1.91 J5.2
N$13
  Top 0.305: R17.2 44.45,36.51 | 44.45,36.51 R16.1 | 43.18,36.51 R16.1 | R16.1 43.4,36.09 42.55,35.24 42.55,32.7 41.91,32.07 38.73,32.07 38.63,32.17 R15.2 | U1.5 44.45,36.51
N$14
  Bottom 0.254: J5.1 6.77,3.07 R38.1
N$15  (via drill 0.5)
  Top 0.305: R21.1 v55.24,36.83
  Top 0.406: C4.1 54.93,37.15 v55.24,36.83
  Bottom 0.406: U4.1 56.73,36.83 v55.24,36.83
N$16
  Bottom 0.305: R39.1 7.94,11.64 J6.1
N$17  (via drill 0.5)
  Top 0.406: R23.1 v55.24,49.85 54.93,50.16 C5.1
  Bottom 0.406: U5.1 56.73,49.85 v55.24,49.85
N$18
  Bottom 0.305: Q4.3 20,2.54 J7.2
N$19
  Bottom 0.254: J7.1 18.1,3.17 21.59,3.17 22.33,3.91 R45.1
N$20
  Bottom 0.305: Q5.3 J8.2
N$21
  Top 0.305: U8.7 8.38,48.26
  Top 0.406: 8.38,48.26 5.71,48.26 3.81,46.35 J4.2
N$22
  Top 0.305: U8.6 8.34,49.21
  Top 0.406: 8.34,49.21 2.86,49.21 J4.1
N$23
  Bottom 0.305: R50.1 J8.1
N$24
  Bottom 0.305: R9.1 60.96,8.47 P2.5
N$25
  Bottom 0.305: U7.2 61.17,16.68 61.28,16.58 61.28,15.88 R57.1
N$29
  Top 0.305: C1.1 14.43,33.06
  Top 0.406: 14.43,33.06 Q7.3
  Top 1.27: J1.1 4.49,33.06 Q7.3
N$30
  Top 1.016: R8.1 P1.5
N$31
  Top 0.305: 14.72,40.32 14.68,40.36 Q7.1 | 14.78,40.27 14.61,40.09 R41.1
  Top 0.406: Q1.3 14.78,40.27 14.72,40.32
N$33
  Top 0.406: D1.1 R35.1
N$34
  Top 0.406: R36.1 D2.1
N$44  (via drill 0.5)
  Top 0.406: R47.1 v55.24,45.4 C21.1
  Bottom 0.406: U10.1 56.73,45.4 v55.24,45.4
RST
  Top 0.305: R33.2 33.02,8.99 | 33.02,8.99 P1.3 | R32.1 33.97,8.99 33.02,8.99
SOL_EN
  Top 0.305: P4.6 31.5,53.72 21.59,43.81 21.59,40.64 20.42,39.47 R34.2 17.08,39.47 Q1.2
VCC
  Top 0.305: U8.3 C12.P$1
  Top 0.406: U6.2 9.53,26.77 9.53,26.67 9.42,26.77
  Top 0.61: U8.3 11.75,47.31 11.11,46.67
  pour Top: 0,24.45 20.32,24.45 20.32,32.07 15.56,36.83 13.65,36.83 11.43,39.37 11.43,46.67 9.84,46.67 9.84,45.09 7.3,42.55 2.86,42.55 0,40.01
VCOPT1
  Top 0.254: P2.1 50.8,6.03 48.9,4.45 23.18,4.45 14.92,12.7 9.21,12.7 5.08,16.83 5.08,18.41 3.81,19.68 J2.2
VCOPT2
  Top 0.254: P2.2 53.34,5.4 51.75,3.81 22.86,3.81 14.61,12.06 6.99,12.06 4.45,14.61 4.45,16.51 3.81,17.14 J2.3
VCOPT3
  Top 0.254: J2.4 3.49,14.61 6.67,11.43 14.29,11.43 22.54,3.17 53.98,3.17 55.88,5.4 P2.3
VCOPT4
  Top 0.254: P2.4 58.42,5.4 55.56,2.54 22.23,2.54 13.97,10.79 3.81,10.79 J2.5
VDD  (via drill 0.6)
  Top 0.254: R21.2 59.37,36.93 | 2.33,6.99 v1.27,6.99
  Top 0.305: R3.1 v48.58,49.21 | C18.1 36.62,48.48 37.15,47.94 v39.37,47.94 40.64,46.67 U2.8 40.64,46.99 | v47.31,39.05 R43.1 | v48.58,36.51 R17.1 | R46.2 v32.7,40.01 | R5.2 32.6,45.09 v31.11,45.09 | R12.1 v47.31,26.35 | C2.1 49.85,28.79 v49.85,27.3 | C23.1 2.33,6.99 | R32.2 34.71,11.43 v36.2,11.43
  Top 0.406: v60.96,50.8 60.22,50.8 R23.2 R24.2 | 59.37,36.93 v59.37,38.42 | R21.2 R22.2 | v59.37,28.26 59.37,30.06 R20.2 R19.2 | U1.8 40.43,34.18 v39.37,35.24 37.78,35.24 36.62,36.41 C11.1 | R26.2 32.6,32.07 v30.8,32.07 | R25.2 32.6,28.57 v30.8,28.57 | C17.1 49.85,41.49 v49.85,40.01 | v59.37,41.27 59.37,43.08 R48.2 R47.2
  Top 1.016: v42.86,13.02 R56.2
  Bottom 0.254: R53.2 v14.92,58.42 | v25.4,5.4 25.08,5.08 R45.2
  Bottom 0.305: R52.2 v7.3,59.05 | R54.2 v7.94,53.02 | v56.2,10.16 R9.2 | 24.13,5.08 R45.2 | v9.84,6.35 C15.1 | R38.2 v9.84,4.13 | R50.2 1.27,5.93 v1.27,6.99 | v4.76,11.75 R39.2 | C16.1 10.16,14.07 v10.16,15.56 | v57.15,15.56 C28.1 59.37,16.93 U7.1 | v63.5,15.56 C29.1 | R55.2 v4.76,57.47
  Bottom 0.406: C19.1 R45.2
  other vias: 19.05,15.56 17.78,15.56 16.51,15.56 15.24,15.56 13.97,15.56 12.7,15.56 11.43,15.56 8.89,15.56 7.62,16.51 7.62,17.78 18.41,16.83 17.14,16.83 15.88,16.83 19.68,16.83 7.62,19.05 7.62,20.32 7.62,21.59 7.62,22.86
  pour VDD: 0,63.5 0,52.07 22.86,52.07 22.86,26.67 20.32,24.13 0,24.13 0,0 68.58,0 68.58,63.5
  pour Top: 0,23.81 20.32,23.81 21.91,22.23 21.91,16.19 20.32,14.61 0,14.61
VMAG
  Bottom 0.254: 62.23,11.43 63.5,10.16 P2.6
  Bottom 0.305: R57.2 C30.1 58.42,12.28 58.42,11.75 58.74,11.43 62.23,11.43
VOPT1
  Top 0.305: U1.1 R11.1 36.4,30.38 R14.1 R25.1 29.63,30.38 26.99,33.02 26.99,45.4 34.92,53.34 54.93,53.34 55.88,54.29 P3.5
  Top 0.406: R11.1
VOPT2
  Top 0.305: U1.7 41.91,33.02 41.59,32.7 40.32,32.7 39.16,33.87 R15.1 R18.1 R26.1 30.9,33.87 29.53,35.24 29.53,46.99 35.24,52.7 56.83,52.7 58.42,54.29 P3.6
VOPT3
  Top 0.305: U2.1 R42.1 36.4,43.08 R6.1 R46.1 30.9,43.08 30.16,43.81 30.16,46.67 35.56,52.07 58.74,52.07 60.96,54.29 P3.7
VOPT4
  Top 0.305: R4.1 R5.1 | U2.7 41.91,46.04 41.27,45.4 40.01,45.4 38.52,46.89 R1.1 R4.1 | P3.8 59.69,51.44 36.2,51.44 34.92,50.16 R4.1
VRING1  (via drill 0.5)
  Top 0.305: R14.2 34.92,27.94 35.24,27.62 41.27,27.62 | 41.27,27.62 41.91,28.26 U1.2 | 41.27,27.62 41.27,25.72 41.91,25.08 52.07,25.08 55.24,28.26 v55.24,30.16
  Top 0.406: R20.1 v55.24,30.16 C8.1
  Bottom 0.305: 60.96,29.84 60.33,29.21 55.88,29.21 55.24,29.84
  Bottom 0.406: U3.3 60.96,29.96 60.96,29.84 | 55.24,29.84 v55.24,30.16
VRING2  (via drill 0.5)
  Top 0.305: v55.24,34.61 R22.1 | C9.1 v55.24,34.61 | 44.61,31.27 46.83,31.27 49.21,33.66 54.61,33.66 55.24,34.29 v55.24,34.61 | 44.61,31.27 36.35,31.27 35.46,32.17 R18.2 | U1.6 43.18,32.7 44.61,31.27
  Bottom 0.305: U4.3 60.21,33.66 55.88,33.66 55.24,34.29 55.56,34.61
  Bottom 0.406: 55.24,34.29 v55.24,34.61
VRING3  (via drill 0.5)
  Top 0.305: R48.1 v55.24,43.18 | R6.2 34.92,40.64 35.24,40.32 41.27,40.32 | C22.1 v55.24,43.18 | 41.27,40.32 41.27,38.42 41.91,37.78 49.85,37.78 v55.24,43.18 | 41.27,40.32 41.91,40.96 U2.2
  Bottom 0.406: U10.3 60.21,42.23 56.2,42.23 v55.24,43.18
VRING4  (via drill 0.5)
  Top 0.305: v55.24,47.62 R24.1 | C10.1 v55.24,47.62 | 44.61,43.97 36.77,43.97 35.56,45.19 R4.2 | U2.6 43.18,45.4 44.61,43.97 | 44.61,43.97 47.31,46.67 54.61,46.67 55.24,47.31 v55.24,47.62
  Bottom 0.406: U5.3 60.21,46.67 56.2,46.67 v55.24,47.62

### Text on the board
Document: Velocity Robotics. | 620C. | MOTOR CONTROL/SENSORS/INTERFACE. / REV. 2. | 0x10C33901